# Altium schematic sheet CH32V103R-R1-1v1.SchDoc
size 406 x 281 mm; SheetNumber: 0; SheetTotal: 0
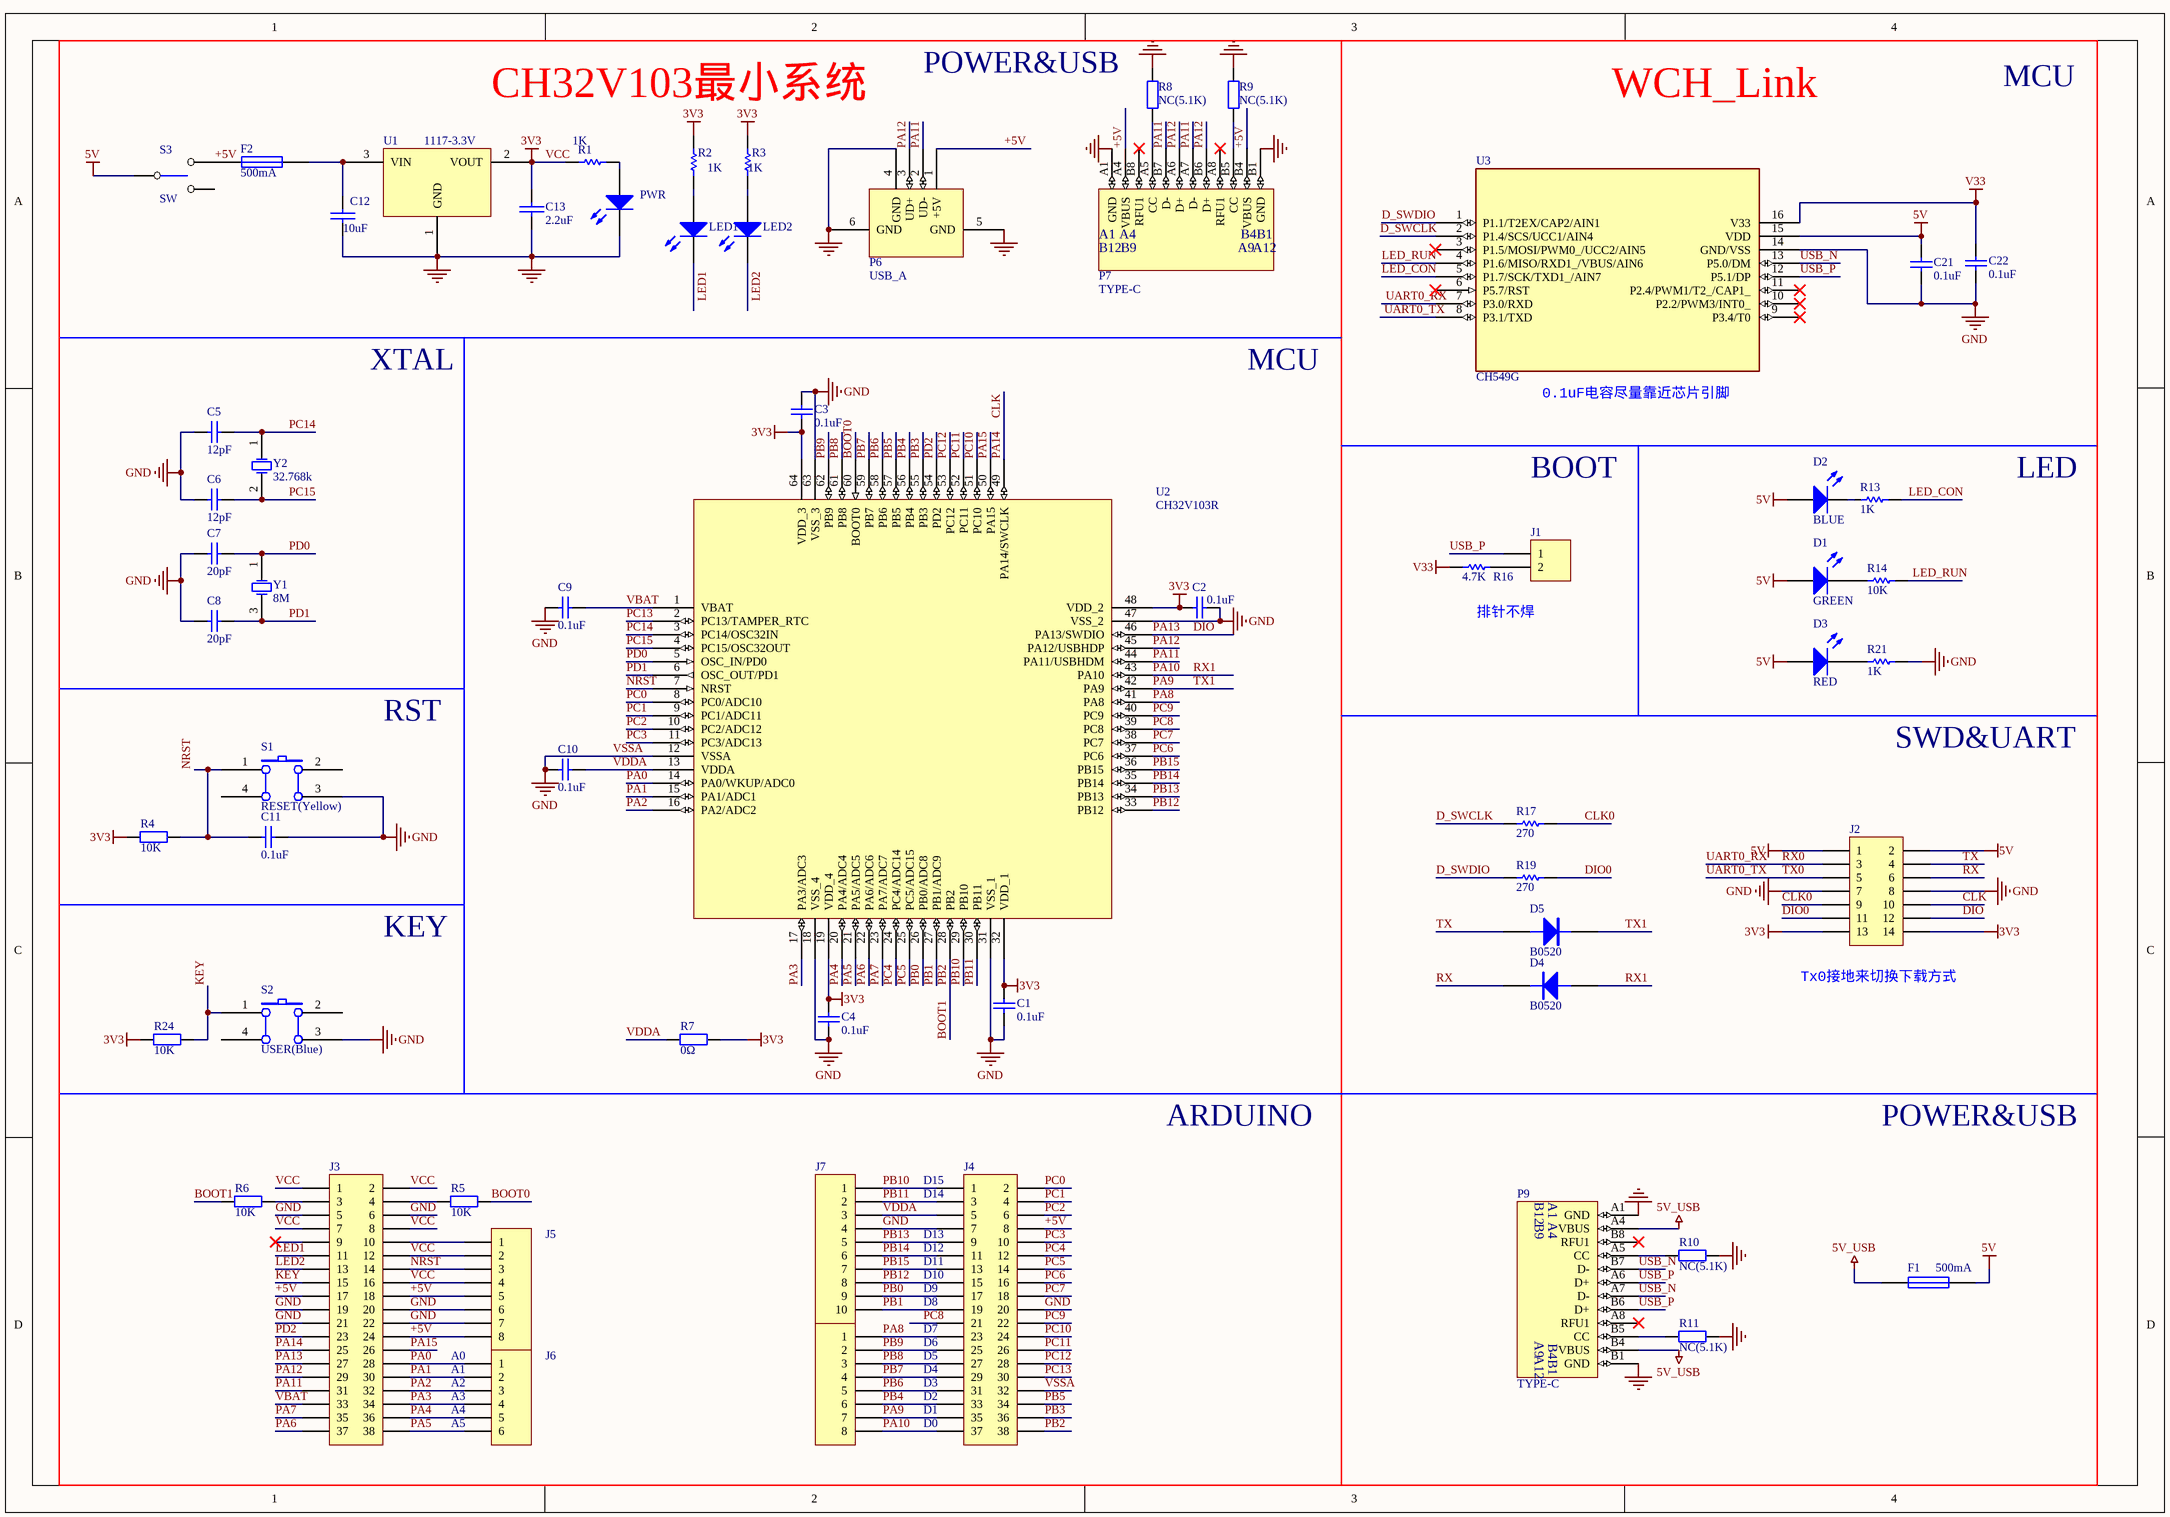
[diagram p0: CH32V103R-R1-1v1.SchDoc]

## Parts
C1  0.1uF  [0603_C]
C2  0.1uF  [0603_C]
C3  0.1uF  [0603_C]
C4  0.1uF  [0603_C]
C5  12pF  [0603_C]
C6  12pF  [0603_C]
C7  20pF  [0603_C]
C8  20pF  [0603_C]
C9  0.1uF  [0603_C]
C10  0.1uF  [0603_C]
C11  0.1uF  [0603_C]
C12  10uF  [3216_C]
C13  2.2uF  [0603_C]
C21  0.1uF  [0603_C]
C22  0.1uF  [0603_C]
D1  GREEN  [0603+]
D2  BLUE  [0603+]
D3  RED  [0603+]
D4  B0520  [SOD-323]
D5  B0520  [SOD-323]
F1  500mA  [0805]
F2  500mA  [0805]
J1  Header 2  [SIP2-2.54MM]  (value not drawn)
J2  Header 7X2  [IDC14-2.54mm]  (value not drawn)
J3  Header 19X2  [IDC38-2.54mm]  (value not drawn)
J4  Header 19X2  [IDC38-2.54mm]  (value not drawn)
J5  Header 8  [SIP8-2.54mm]  (value not drawn)
J6  Header 6  [SIP6-2.54MM]  (value not drawn)
J7  Header 10  [SIP10-2.54mm]  (value not drawn)
J8  Header 8  [SIP8-2.54mm]  (value not drawn)
LED1  LED1   blue  [0603+]  (value not drawn)
LED2  LED2  blue  [0603+]  (value not drawn)
P6  USB_A  [USBAF]
P7  TYPE-C  [TYPE-C-Receptacle-2.0]
P9  TYPE-C  [TYPE-C-Receptacle-2.0]
PWR  POWER  red  [0603+]  (value not drawn)
R1  1K  [0603]
R2  1K  [0603]
R3  1K  [0603]
R4  10K  [0603]
R5  10K  [0603]
R6  10K  [0603]
R7  0Ω  [0603]
R8  NC(5.1K)  [0603]
R9  NC(5.1K)  [0603]
R10  NC(5.1K)  [0603]
R11  NC(5.1K)  [0603]
R13  1K  [0603]
R14  10K  [0603]
R16  4.7K  [0603]
R17  270  [0603]
R19  270  [0603]
R21  1K  [0603]
R24  10K  [0603]
S1  RESET(Yellow)  [KEYX]
S2  USER(Blue)  [KEYX]
S3  SW  [KEY2]
U1  1117-3.3V  [SOT-223]
U2  CH32V103R  [LQFP64M_10X10]
U3  CH549G  [SOP16]
Y1  8M  [XT3225]
Y2  32.768k  [FC-135]

## Nets
5V: C21.1 D1.1(A) D2.1(A) D3.1(A) F1.2 J2.1 J2.2 S3.1 U3.15(VDD)
5V_USB: F1.1 P9.A4(VBUS) P9.B4(VBUS)
GND: C1.1 C2.1 C3.1 C4.1 C5.2 C6.2 C7.1 C8.1 C9.2 C10.2 C11.1 C12.2 C13.2 C21.2 C22.2 J2.7 J2.8 J3.5 J3.6 J3.19 J3.20 J3.21 J3.22 J4.7 J4.20 J4.32 J5.6 J5.7 J7.4 P6.4(GND) P6.5(GND) P6.6(GND) P7.A1(GND) P7.B1(GND) P9.A1(GND) P9.B1(GND) PWR.2(K) R8.1 R9.1 R10.2 R11.2 R21.1 S1.3(B1) S2.3(B1) U1.1(GND) U2.12(VSSA) U2.18(VSS_4) U2.31(VSS_1) U2.47(VSS_2) U2.63(VSS_3) U3.14(GND/VSS)  [also labelled VSSA]
V33: C22.1 R16.2 U3.16(V33)
VCC: C1.2 C2.2 C3.2 C4.2 C13.1 J2.13 J2.14 J3.1 J3.2 J3.7 J3.8 J3.12 J3.16 J5.2 J5.4 R1.2 R2.1 R3.1 R4.2 R7.1 R24.2 U1.2(VOUT) U2.19(VDD_4) U2.32(VDD_1) U2.48(VDD_2) U2.64(VDD_3)  [also labelled 3V3]
+5V: F2.1 J3.17 J3.18 J3.24 J4.8 J5.5 J5.8 P6.1(+5V) P7.A4(VBUS) P7.B4(VBUS) S3.3
BOOT0: R5.2 U2.60(BOOT0)
BOOT1: J4.38 R6.1 U2.28(PB2)  [also labelled PB2]
CLK: J2.10 J3.25 U2.49(PA14/SWCLK)  [also labelled PA14]
CLK0: J2.9 R17.1
D_SWCLK: R17.2 U3.2(P1.4/SCS/UCC1/AIN4)
D_SWDIO: R19.2 U3.1(P1.1/T2EX/CAP2/AIN1)
DIO: J2.12 J3.27 U2.46(PA13/SWDIO)  [also labelled PA13]
DIO0: J2.11 R19.1
KEY: J3.15 R24.1 S2.1(A0)
LED1: J3.11 LED1.2(K)
LED2: J3.13 LED2.2(K)
LED_CON: R13.1 U3.5(P1.7/SCK/TXD1_/AIN7)
LED_RUN: R14.1 U3.4(P1.6/MISO/RXD1_/VBUS/AIN6)
NRST: C11.2 J3.14 J5.3 R4.1 S1.1(A0) U2.7(NRST)
PA0: J3.28 J6.1 U2.14(PA0/WKUP/ADC0)
PA1: J3.30 J6.2 U2.15(PA1/ADC1)
PA2: J3.32 J6.3 U2.16(PA2/ADC2)
PA3: J3.34 J6.4 U2.17(PA3/ADC3)
PA4: J3.36 J6.5 U2.20(PA4/ADC4)
PA5: J3.38 J6.6 U2.21(PA5/ADC5)
PA6: J3.37 U2.22(PA6/ADC6)
PA7: J3.35 U2.23(PA7/ADC7)
PA8: J4.23 J8.1 U2.41(PA8)
PA9: D5.2(K) J4.35 J8.7 U2.42(PA9)  [also labelled TX1]
PA10: D4.1(A) J4.37 J8.8 U2.43(PA10)  [also labelled RX1]
PA11: J3.31 P6.2(UD-) P7.A7(D-) P7.B7(D-) U2.44(PA11/USBHDM)
PA12: J3.29 P6.3(UD+) P7.A6(D+) P7.B6(D+) U2.45(PA12/USBHDP)
PA15: J3.26 U2.50(PA15)
PB0: J4.17 J7.9 U2.26(PB0/ADC8)
PB1: J4.19 J7.10 U2.27(PB1/ADC9)
PB3: J4.36 U2.55(PB3)
PB4: J4.33 J8.6 U2.56(PB4)
PB5: J4.34 U2.57(PB5)
PB6: J4.31 J8.5 U2.58(PB6)
PB7: J4.29 J8.4 U2.59(PB7)
PB8: J4.27 J8.3 U2.61(PB8)
PB9: J4.25 J8.2 U2.62(PB9)
PB10: J4.1 J7.1 U2.29(PB10)
PB11: J4.3 J7.2 U2.30(PB11)
PB12: J4.15 J7.8 U2.33(PB12)
PB13: J4.9 J7.5 U2.34(PB13)
PB14: J4.11 J7.6 U2.35(PB14)
PB15: J4.13 J7.7 U2.36(PB15)
PC0: J4.2 U2.8(PC0/ADC10)
PC1: J4.4 U2.9(PC1/ADC11)
PC2: J4.6 U2.10(PC2/ADC12)
PC3: J4.10 U2.11(PC3/ADC13)
PC4: J4.12 U2.24(PC4/ADC14)
PC5: J4.14 U2.25(PC5/ADC15)
PC6: J4.16 U2.37(PC6)
PC7: J4.18 U2.38(PC7)
PC8: J4.21 U2.39(PC8)
PC9: J4.22 U2.40(PC9)
PC10: J4.24 U2.51(PC10)
PC11: J4.26 U2.52(PC11)
PC12: J4.28 U2.53(PC12)
PC13: J4.30 U2.2(PC13/TAMPER_RTC)
PC14: C5.1 U2.3(PC14/OSC32IN) Y2.1(OSC1)
PC15: C6.1 U2.4(PC15/OSC32OUT) Y2.2(OSC2)
PD0: C7.2 U2.5(OSC_IN/PD0) Y1.1(OSC1)
PD1: C8.2 U2.6(OSC_OUT/PD1) Y1.3(OSC2)
PD2: J3.23 U2.54(PD2)
RX: D4.2(K) J2.6
RX0: J2.3 U3.7(P3.0/RXD)  [also labelled UART0_RX]
TX: D5.1(A) J2.4
TX0: J2.5 U3.8(P3.1/TXD)  [also labelled UART0_TX]
USB_N: P9.A7(D-) P9.B7(D-) U3.13(P5.0/DM)
USB_P: J1.1 P9.A6(D+) P9.B6(D+) U3.12(P5.1/DP)
VBAT: C9.1 J3.33 U2.1(VBAT)
VDDA: C10.1 J4.5 J7.3 R7.2 U2.13(VDDA)
NetC12_1: C12.1 F2.2 U1.3(VIN)
NetD1_2: D1.2(K) R14.2
NetD2_2: D2.2(K) R13.2
NetD3_2: D3.2(K) R21.2
NetJ1_2: J1.2 R16.1
NetJ3_3: J3.3 R6.2
NetJ3_4: J3.4 R5.1
NetJ3_10: J3.10 J5.1
NetLED1_1: LED1.1(A) R2.2
NetLED2_1: LED2.1(A) R3.2
NetP7_A5: P7.A5(CC) R8.2
NetP7_B5: P7.B5(CC) R9.2
NetP9_A5: P9.A5(CC) R10.1
NetP9_B5: P9.B5(CC) R11.1
NetPWR_1: PWR.1(A) R1.1

Not connected (* = marked no-connect by the designer): J3 9*; P7 A8(RFU1)* B8(RFU1)*; P9 A8(RFU1)* B8(RFU1)*; S1 2(B0) 4(A1); S2 2(B0) 4(A1); S3 2; U3 3(P1.5/MOSI/PWM0_/UCC2/AIN5)* 6(P5.7/RST)* 9(P3.4/T0)* 10(P2.2/PWM3/INT0_)* 11(P2.4/PWM1/T2_/CAP1_)*

## Notes on the sheet
- CH32V103最小系统
- POWER&USB
- WCH_Link
- MCU
- XTAL
- 0.1uF电容尽量靠近芯片引脚
- BOOT
- LED
- 排针不焊
- RST
- SWD&UART
- KEY
- (near J2) Tx0接地来切换下载方式
- ARDUINO
- (near J4) D14
- (near J4) D15
- (near J4) D11
- (near J4) D12
- (near J4) D13
- (near J4) D7
- (near J4) D8
- (near J4) D9
- (near J4) D10
- A0
- A1
- (near J6) A2
- (near J6) A3
- (near J4) D2
- (near J4) D3
- (near J4) D4
- (near J4) D5
- (near J4) D6
- (near J6) A4
- (near J6) A5
- (near J4) D0
- (near J4) D1
- Title
- Size:
- Date:
- Number:
- Time:
- Revision:
- Sheet
- of
- File:
- (in symbol TYPE-C1) B12; B9; A9; A12

## Library data of the parts
C1-C11 = Cap: Capacitor
C12 C13 = CAP: Capacitor
C21 C22 = C0603: Capacitor; Published: 8-Jun-2000; LatestRevisionDate: 17-Jul-2002; LatestRevisionNote: Re-released for DXP Platform.; PackageReference: RAD-0.3; Publisher: Altium Limited; PackageDescription: Radial Cap, Thru-Hole; 2 Leads; 0.3 in Pin Spacing
D1-D3 = D0603: Typical RED, GREEN, YELLOW, AMBER GaAs LED; Published: 8-Jun-2000; LatestRevisionDate: 17-Jul-2002; LatestRevisionNote: Re-released for DXP Platform.; PackageVersion: Feb-2002; PackageReference: 3.2X1.6X1.1; Publisher: Altium Limited; PackageDescription: SM LED; 2 Flat Leads
D4 D5 = DIODE
F1 F2 = FUSE1: Fuse
J1 = Header 2: Header, 2-Pin; LatestRevisionDate: 17-Jul-2002; LatestRevisionNote: Re-released for DXP Platform.; Publisher: Altium Limited
J2 = Header 7X2: Header, 7-Pin, Dual row; LatestRevisionDate: 17-Jul-2002; LatestRevisionNote: Re-released for DXP Platform.; Publisher: Altium Limited
J3 J4 = Header 19X2: Header, 19-Pin, Dual row; LatestRevisionDate: 17-Jul-2002; LatestRevisionNote: Re-released for DXP Platform.; Publisher: Altium Limited
J5 J8 = Header 8: Header, 8-Pin; LatestRevisionDate: 17-Jul-2002; LatestRevisionNote: Re-released for DXP Platform.; Publisher: Altium Limited
J6 = Header 6: Header, 6-Pin; LatestRevisionDate: 17-Jul-2002; LatestRevisionNote: Re-released for DXP Platform.; Publisher: Altium Limited
J7 = Header 10: Header, 10-Pin; LatestRevisionDate: 17-Jul-2002; LatestRevisionNote: Re-released for DXP Platform.; Publisher: Altium Limited
LED1 LED2 PWR = LED0: Typical INFRARED GaAs LED; Published: 8-Jun-2000; LatestRevisionDate: 08-Jul-2005; LatestRevisionNote: Mech Layer 1 removed.; PackageReference: LED-0; Publisher: Altium Limited
P6 = USB: USB Port
P7 P9 = TYPE-C1
R1-R3 = Res Semi: Semiconductor Resistor
R4-R11 R24 = Res2: Resistor
R13 R14 R16 R17 R19 R21 = R0603: Resistor; Published: 8-Jun-2000; LatestRevisionDate: 17-Jul-2002; LatestRevisionNote: Re-released for DXP Platform.; PackageReference: AXIAL-0.3; Publisher: Altium Limited; PackageDescription: Axial Device, Thru-Hole; 2 Leads; 0.3 in Pin Spacing
S1 S2 = SW PUSHBUTTON: SE PUSHBUTTON
U2 = CH32V103R: RISC-V MCU with USB device & USB host & ADC & Touch Key
U3 = CH549G: 8bit MCS51 MCU with ADC & USB type-C host & device & dual UART & SPI
Y1 Y2 = XTAL: Crystal Oscillator; Published: 8-Jun-2000; LatestRevisionDate: 17-Jul-2002; LatestRevisionNote: Re-released for DXP Platform.; PackageReference: R38; Publisher: Altium Limited